# Altium schematic sheet Amplifiers.SchDoc
size A4; SheetNumber: 7; SheetTotal: 9
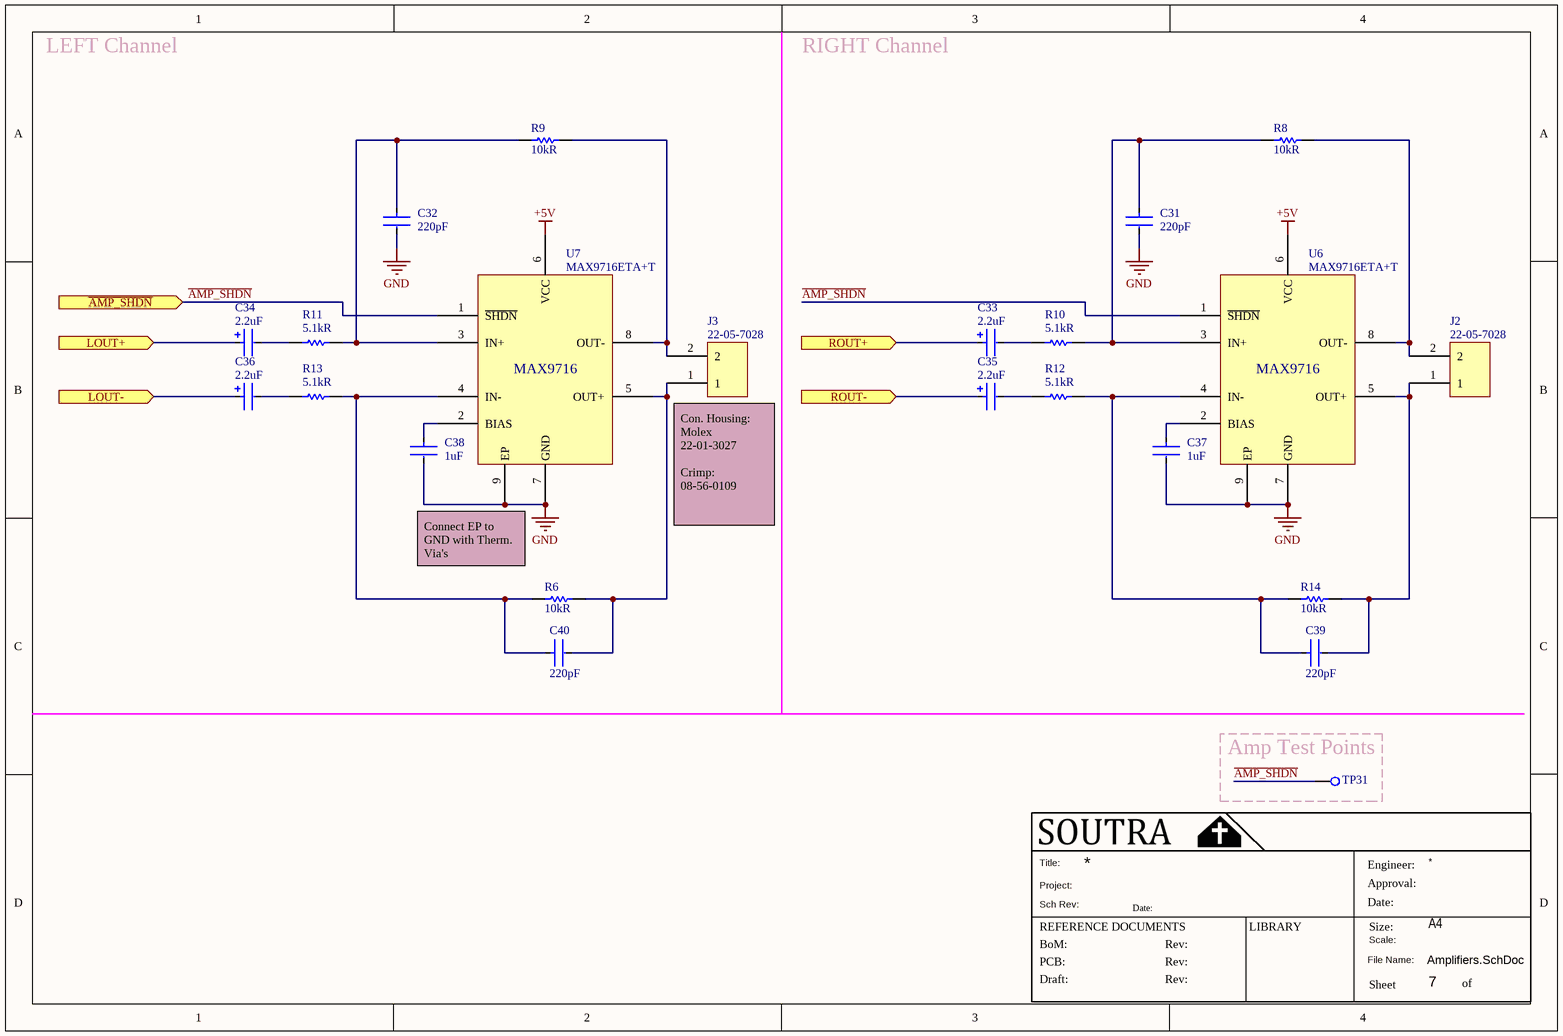
[diagram p0: Amplifiers.SchDoc]

## Parts
C31  value 220pF  [CAPC1005X06L]  (hidden comment: CC0402KPX7R9BB221)
C32  value 220pF  [CAPC1005X06L]  (hidden comment: CC0402KPX7R9BB221)
C33  value 2.2uF  [CAPC2113X120X50ML20T30]  (hidden comment: TAJR225K016RNJ)
C34  value 2.2uF  [CAPC2113X120X50ML20T30]  (hidden comment: TAJR225K016RNJ)
C35  value 2.2uF  [CAPC2113X120X50ML20T30]  (hidden comment: TAJR225K016RNJ)
C36  value 2.2uF  [CAPC2113X120X50ML20T30]  (hidden comment: TAJR225K016RNJ)
C37  value 1uF  [CAPC1005X06L]  (hidden comment: CC0402KRX5R6BB105)
C38  value 1uF  [CAPC1005X06L]  (hidden comment: CC0402KRX5R6BB105)
C39  value 220pF  [CAPC1005X06L]  (hidden comment: CC0402KPX7R9BB221)
C40  value 220pF  [CAPC1005X06L]  (hidden comment: CC0402KPX7R9BB221)
J2  22-05-7028  [J_MOLEX_22-05-7028]
J3  22-05-7028  [J_MOLEX_22-05-7028]
R6  value 10kR  [RESC_0805_2013X50X30LL20T20]  (hidden comment: RC0805JR-0710KL)
R8  value 10kR  [RESC_0805_2013X50X30LL20T20]  (hidden comment: RC0805JR-0710KL)
R9  value 10kR  [RESC_0805_2013X50X30LL20T20]  (hidden comment: RC0805JR-0710KL)
R10  value 5.1kR  [RESC_0603_1608X06L]  (hidden comment: MCMR06X512JTL)
R11  value 5.1kR  [RESC_0603_1608X06L]  (hidden comment: MCMR06X512JTL)
R12  value 5.1kR  [RESC_0603_1608X06L]  (hidden comment: MCMR06X512JTL)
R13  value 5.1kR  [RESC_0603_1608X06L]  (hidden comment: MCMR06X512JTL)
R14  value 10kR  [RESC_0805_2013X50X30LL20T20]  (hidden comment: RC0805JR-0710KL)
TP31  TP_CIRCLE_R1  [TP_CIRCLE_R1]  (value not drawn)
U6  MAX9716ETA+T  [TDFN300X300X80_HS-9L]
U7  MAX9716ETA+T  [TDFN300X300X80_HS-9L]

## Blocks framed on the sheet
Amp Test Points: TP31

## Ports
LOUT+ (in, see Block Diagram[4B], CODEC[3B], IOa[3A]), LOUT- (in, see Block Diagram[4B], CODEC[3B]), ROUT+ (in, see Block Diagram[4B], CODEC[3B], IOa[3A]), ROUT- (in, see Block Diagram[4B], CODEC[3B]), ~{AMP_SHDN} (in, see Block Diagram[3B], MCU[2C])

## Nets
+5V: U6.6(VCC) U7.6(VCC)
GND: C31.2 C32.2 C37.2 C38.2 U6.7(GND) U6.9(EP) U7.7(GND) U7.9(EP)
~{AMP_SHDN}: TP31.1 U6.1(~{SHDN}) U7.1(~{SHDN}) ; port ~{AMP_SHDN}
LOUT+: C34.1 ; port LOUT+
LOUT-: C36.1 ; port LOUT-
ROUT+: C33.1 ; port ROUT+
ROUT-: C35.1 ; port ROUT-
NetC31_1: C31.1 R8.2 R10.2 U6.3(IN+)
NetC32_1: C32.1 R9.2 R11.2 U7.3(IN+)
NetC33_2: C33.2 R10.1
NetC34_2: C34.2 R11.1
NetC35_2: C35.2 R12.1
NetC36_2: C36.2 R13.1
NetC37_1: C37.1 U6.2(BIAS)
NetC38_1: C38.1 U7.2(BIAS)
NetC39_1: C39.1 R12.2 R14.2 U6.4(IN-)
NetC39_2: C39.2 J2.1 R14.1 U6.5(OUT+)
NetC40_1: C40.1 R6.2 R13.2 U7.4(IN-)
NetC40_2: C40.2 J3.1 R6.1 U7.5(OUT+)
NetJ2_2: J2.2 R8.1 U6.8(OUT-)
NetJ3_2: J3.2 R9.1 U7.8(OUT-)

## Notes on the sheet
- LEFT Channel
- RIGHT Channel
- (near J3) Con. Housing:
  Molex 22-01-3027
  Crimp:
  08-56-0109
- Connect EP to GND with Therm. Via's
- Title:
- Project:
- Sch Rev:
- Date:
- Engineer:
- Approval:
- REFERENCE DOCUMENTS
- BoM:
- PCB:
- Draft:
- Rev:
- LIBRARY
- File Name:
- Scale:
- Size:
- Sheet
- A4
- of
- (in symbol MAX9716ETA+T) MAX9716

## Library data of the parts
C31 C32 C39 C40 = CC0402KPX7R9BB221: Ceramic Capacitor, Multilayer, Ceramic, 50V, 10% +Tol, 10% -Tol, X7R, 15% TC, 0.00022uF, Surface Mount, 0402; Manufacturer: Yageo; Alternative Part: MC0402B221K500CT; Multilayer: Yes; Supplier 1: Farnell; Supplier Part Number 1: 4254872; Manufacturer Part Number: CC0402KPX7R9BB221; RoHS: Yes; Category: Ceramic Capacitors; Stock 1: 49750; Pricing 1: 10=0.0069, 500=0.0055, 2500=0.0042, 10000=0.003, 25000=0.0029, 50000=0.0028, 250000=0.0027, 500000=0.0026 (GBP); Mounting Technology: Surface Mount; Pins: 2; Dielectric Material: Ceramic; Package Shape: Rectangular; Case/Package: 0402; Terminal Finish: Nickel; Min Operating Temperature: -55°C; Max Operating Temperature: 125°C; JESD-609 Code: e3; Capacitor Type: Ceramic; Tolerance  (fill in as +-): 10%; Package Style: SMTMeter; Packaging: Tape and Reel; Tolerance (fill in as +-): 10%; Rated DC Voltage (URdc): 50V; Temperature Characteristics Code: X7R; Termination: Wraparound; Length: 1mm; Width: 0.5mm; Height: 0.5mm; Reach SVHC Compliant: Yes; RoHS Compliant: Yes; ComponentLink1URL: https://datasheet.ciiva.com:443/pdfs/VipMasterIC/IC/YAGO/YAGO-S-A0003557223/YAGO-S-A0003557223-1.pdf?src-supplier=IHS+Markit; ComponentLink1Description: https://datasheet.ciiva.com:443/pdfs/VipMasterIC/IC/YAGO/YAGO-S-A0003557223/YAGO-S-A0003557223-1.pdf?src-supplier=IHS+Markit; ComponentLink2URL: https://datasheet.ciiva.com/13208/upy-gphc-x7r-6-3v-to-50v-8-12304-13208487.pdf?src-supplier=Mouser; ComponentLink2Description: https://datasheet.ciiva.com/13208/upy-gphc-x7r-6-3v-to-50v-8-12304-13208487.pdf?src-supplier=Mouser; Supplier 2: Digikey; Supplier Part Number 2: 311-1035-1-ND; Stock 2: 333936; Pricing 2: 1=0.08, 10=0.016, 50=0.0092, 100=0.007; Alternative Part Supplier: Farnell; Alternative Part Supplier Part Number: 1758981
C33-C36 = TAJR225K016RNJ: Surface Mount Tantalum Capacitor, 2.2 µF, 16 V, 0805 [2012 Metric], ± 10%, 6.5 ohm, R; Manufacturer: AVX Interconnect / Elco; Part Number: TAJR225K016RNJ; Supplier 1: Farnell; Supplier Part Number 1: 2112773; Pricing 1: 5=0.3684, 50=0.2592; Stock 1: 340; Manufacturer Part Number: TAJR225K016RNJ
C37 C38 = CC0402KRX5R6BB105: Ceramic Capacitor, Multilayer, Ceramic, 10V, 10% +Tol, 10% -Tol, X5R, 15% TC, 1uF, Surface Mount, 0402; Manufacturer: Yageo; Alternative Part: 0402ZD105KAT2A; Alternative Part Manufacturer: KYOCERA AVX; Multilayer: Yes; Supplier: Farnell; Supplier Part Number: 1458896; Manufacturer Part Number: CC0402KRX5R6BB105; RoHS: Yes; Category: Ceramic Capacitors; Stock: 12220000; Pricing: 10=0.039, 100=0.023; Mounting Technology: Surface Mount; Pins: 2; Dielectric Material: Ceramic; Package Shape: Rectangular; Case/Package: 0402; Terminal Finish: Nickel; Min Operating Temperature: -55°C; Max Operating Temperature: 85°C; JESD-609 Code: e3; Capacitor Type: Ceramic; Tolerance  (fill in as +-): 10%; Package Style: SMTMeter; Packaging: Tape and Reel; Tolerance (fill in as +-): 10%; Rated DC Voltage (URdc): 10V; Temperature Characteristics Code: X5R; Termination: Wraparound; Length: 1mm; Width: 0.5mm; Height: 0.5mm; Reach SVHC Compliant: Yes; RoHS Compliant: Yes; ComponentLink1URL: https://datasheet.ciiva.com:443/pdfs/VipMasterIC/IC/YAGO/YAGO-S-A0006851646/YAGO-S-A0006851646-1.pdf?src-supplier=IHS+Markit; ComponentLink1Description: https://datasheet.ciiva.com:443/pdfs/VipMasterIC/IC/YAGO/YAGO-S-A0006851646/YAGO-S-A0006851646-1.pdf?src-supplier=IHS+Markit; ComponentLink2URL: https://datasheet.ciiva.com/176/upy-gphc-x5r-4v-to-50v-12-176704.pdf?src-supplier=Digi-Key; ComponentLink2Description: https://datasheet.ciiva.com/176/upy-gphc-x5r-4v-to-50v-12-176704.pdf?src-supplier=Digi-Key; ComponentLink3URL: https://datasheet.ciiva.com/176/mlccorderingcode-176705.pdf?src-supplier=Digi-Key; ComponentLink3Description: https://datasheet.ciiva.com/176/mlccorderingcode-176705.pdf?src-supplier=Digi-Key; ComponentLink4URL: https://datasheet.ciiva.com/176/mlccorderingcode-176706.pdf?src-supplier=Digi-Key; ComponentLink4Description: https://datasheet.ciiva.com/176/mlccorderingcode-176706.pdf?src-supplier=Digi-Key; Supplier 1: Digikey; Supplier Part Number 1: 311-1439-1-ND; Pricing 1: 1=0.08, 10=0.058, 50=0.034, 100=0.027; Alternative Part Supplier: Farnell; Alternative Part Supplier Part Number: 1740588
J2 J3 = 22-05-7028: Board Connector, 2 Contact(s), 1 Row(s), Male, Right Angle, 0.1 inch Pitch, Solder Terminal, Locking, Natural Insulator, Receptacle; Manufacturer: Molex; Option: General Purpose; Filter Feature: No; Mating Information: MULTIPLE MATING PARTS AVAILABLE; Number of Rows Loaded: 1; Number of Contacts: 2; Contact Pattern: RECTANGULAR; Contact Resistance: 10mR; Contact Style: SQ PIN-SKT; Durability: 50Cycles; Insulation Resistance: 1GR; Polarization Key: POLARIZED HOUSING; Rated Current (Signal): 4A; Body Breadth: 0.228inch; Body Depth: 0.568inch; Body Length: 0.2inch; Plating Thickness: 60uin; Reference Standard: UL; Reliability: COMMERCIAL; Insertion Force-Max: 1.946N; Withdrawl Force-Min: 0.556N; Supplier 1: Farnell; Supplier Part Number 1: 9731601; Manufacturer Part Number: 22-05-7028; RoHS: Yes; Category: Headers and Wire Housings; Mounting Technology: Board; Contact Finish - Mating: TIN (200); Contact Finish - Termination: Tin (Sn); Insulation Color: Natural; Insulation Material: Nylon; Min Operating Temperature: -40°C; Max Operating Temperature: 105°C; Connector Type: BOARD CONNECTOR; Contact Gender: Male; Mixed Contacts: No; Mounting Style: RIGHT ANGLE; Termination: Solder; JESD-609 Code: e3; Body/Shell Style: RECEPTACLE; Number Of Connectors: 1; Number Of PCB Rows: 1; PCB Contact Pattern: RECTANGULAR; Terminal Pitch: 2.54mm; Mating Contact Pitch: 0.1inch; Mounting Option 1: LOCKING; Terminal Length: 0.15inch; Flammability Rating: UL94 V-0; Reach SVHC Compliant: Yes; RoHS Compliant: Yes; DIN Conformance: No; IEC Conformance: No; MIL Conformance: No; ComponentLink1URL: https://datasheet.ciiva.com:443/pdfs/VipMasterIC/IC/MOLE/MOLE-S-A0002841204/MOLE-S-A0002841204-1.pdf?src-supplier=IHS+Markit; ComponentLink1Description: https://datasheet.ciiva.com:443/pdfs/VipMasterIC/IC/MOLE/MOLE-S-A0002841204/MOLE-S-A0002841204-1.pdf?src-supplier=IHS+Markit; ComponentLink2URL: http://www.farnell.com/datasheets/2700806.pdf?src-supplier=Farnell; ComponentLink2Description: http://www.farnell.com/datasheets/2700806.pdf?src-supplier=Farnell; Stock 1: 34887; Pricing 1: 1=0.78, 10=0.64, 50=0.57, 100=0.50; ComponentLink3URL: http://datasheet.octopart.com/22-05-7028-Molex-datasheet-10979095.pdf?src-supplier=Avnet; ComponentLink3Description: http://datasheet.octopart.com/22-05-7028-Molex-datasheet-10979095.pdf?src-supplier=Avnet
R6 R8 R9 R14 = RC0805JR-0710KL: Fixed Resistor, Metal Glaze/thick Film, 0.125W, 10000ohm, 150V, 5% +/-Tol, 100ppm/Cel, Surface Mount, 0805; Manufacturer: Yageo; Alternative Part: MCMR08X103 JTL; Additional Feature: LASER TRIMMABLE; Power: 125mW; Rated Temperature: 70°C; Temperature Coefficient: 100ppm/°C; Package Height: 0.5mm; Package Length: 2mm; Package Width: 1.25mm; Supplier: Farnell; Supplier Part Number: 9234136; Manufacturer Part Number: RC0805JR-0710KL; RoHS: Yes; Category: Chip SMD Resistors; Stock: 893694; Pricing: 10=0.013, 100=0.007, 500=0.006; Mounting Technology: Surface Mount; Pins: 2; Package Shape: Rectangular; Case/Package: 0805; Terminal Finish: Nickel; Min Operating Temperature: -55°C; Max Operating Temperature: 155°C; Tolerance: 5%; JESD-609 Code: e3; Resistor Type: FIXED RESISTOR; Construction: Chip; Package Style: SMTMeter; Packaging: Tape and Reel; Technology: METAL GLAZE/THICK FILM; Termination: Wraparound; Working Voltage: 150V; Reach SVHC Compliant: Yes; RoHS Compliant: Yes; ComponentLink1URL: https://datasheet.ciiva.com:443/pdfs/VipMasterIC/IC/YAGO/YAGO-S-A0008145938/YAGO-S-A0008145938-1.pdf?src-supplier=IHS+Markit; ComponentLink1Description: https://datasheet.ciiva.com:443/pdfs/VipMasterIC/IC/YAGO/YAGO-S-A0008145938/YAGO-S-A0008145938-1.pdf?src-supplier=IHS+Markit; ComponentLink2URL: https://datasheet.ciiva.com/7983/444164-7983765.pdf?src-supplier=Element14; ComponentLink2Description: https://datasheet.ciiva.com/7983/444164-7983765.pdf?src-supplier=Element14; ComponentLink3URL: https://datasheet.ciiva.com/7941/444164-7941870.pdf?src-supplier=Element14; ComponentLink3Description: https://datasheet.ciiva.com/7941/444164-7941870.pdf?src-supplier=Element14; ComponentLink4URL: https://datasheet.ciiva.com/7941/444164-7941871.pdf?src-supplier=Element14; ComponentLink4Description: https://datasheet.ciiva.com/7941/444164-7941871.pdf?src-supplier=Element14; Supplier 1: Digikey; Supplier Part Number 1: 311-10KARCT-ND; Pricing 1: 1=0.08, 10=0.018, 50=0.011, 100=0.009; Alternative Part Supplier: Farnell; Alternative Part Supplier Part Number: 2073612
R10-R13 = MCMR06X512JTL: Fixed Resistor, 0.1W, 5100ohm, 75V, 5% +/-Tol, 100ppm/Cel, Surface Mount, 0603; Manufacturer: Multicomp; Manufacturer Series: MCMR06; Alternative Part: MCMR06X5101FTL; Power: 100mW; Rated Temperature: 70°C; Temperature Coefficient: 100ppm/°C; Reference Standard: AEC-Q200; Supplier 1: Farnell; Supplier Part Number 1: 2073528; Manufacturer Part Number: MCMR06X512JTL; RoHS: Yes; Category: Chip SMD Resistors; Stock 1: 4951; Pricing 1: 10=0.0065, 100=0.0056, 500=0.0047, 1000=0.004, 2500=0.0027, 5000=0.0021, 25000=0.0016, 50000=0.0013 (GBP); Mounting Technology: Surface Mount; Pins: 2; Package Shape: Rectangular; Case/Package: 0603; Terminal Finish: Tin; Min Operating Temperature: -55°C; Max Operating Temperature: 155°C; Tolerance: 5%; JESD-609 Code: e3; Resistor Type: FIXED RESISTOR; Packaging: Tape and Reel; Termination: Wraparound; Working Voltage: 75V; RoHS Compliant: Yes; ComponentLink1URL: https://datasheet.ciiva.com:443/pdfs/VipMasterIC/IC/SCMP/SCMPS00167/SCMPS00167-1.pdf?src-supplier=IHS+Markit; ComponentLink1Description: https://datasheet.ciiva.com:443/pdfs/VipMasterIC/IC/SCMP/SCMPS00167/SCMPS00167-1.pdf?src-supplier=IHS+Markit; ComponentLink2URL: https://datasheet.ciiva.com/28686/1716707-28686598.pdf?src-supplier=Element14; ComponentLink2Description: https://datasheet.ciiva.com/28686/1716707-28686598.pdf?src-supplier=Element14; Alternative Part Supplier: Farnell; Alternative Part Supplier Part Number: 2073522
TP31 = TP_CIRCLE_R1: Test Point, SMD, Circular, Radius = 1mm
U6 U7 = MAX9716ETA+T: Audio Amplifier, 1.4W, 1 Channel(s), 1 Func, BICMOS; Manufacturer: Maxim; Bandwidth-Nom: 22kHz; Number of Channels: 1; Package Equivalence Code: SOLCC8,.12,25; Power Supplies: 3/5V; Max Supply Current: 8mA; Max Supply Voltage: 5.5V; Min Supply Voltage: 2.7V; Qualification Status: Not Qualified; Supplier: Farnell; Supplier Part Number: 2516304; Manufacturer Part Number: MAX9716ETA+T; RoHS: Yes; Category: Amplifiers - Audio; Stock: 3265; Pricing: 1=1.41, 10=1.26, 25=1.19, 100=0.982; Case/Package: HVSON; Pins: 8; Package Shape: Square; Terminal Finish: Tin; Min Operating Temperature: -40°C; Max Operating Temperature: 85°C; JESD-609 Code: e3; Consumer IC Type: AUDIO AMPLIFIER; JESD-30 Code: S-XDSO-N8; Moisture Sensitivity Level: 1; Channels: 1; Output Power-Nom: 1.4W; Package Style: SMALL OUTLINE, HEAT SINK/SLUG, VERY THIN PROFILEMeter; Peak Reflow Temperature (Cel): 260°C; Surface Mount: Yes; Technology: BICMOS; Terminal Form: No Lead; Terminal Position: DUAL; Length: 3mm; Width: 3mm; Height - Seated (Max): 0.8mm; Terminal Pitch: 0.65mm; Temperature Grade: INDUSTRIAL; Reach SVHC Compliant: Yes; RoHS Compliant: Yes; ComponentLink1URL: https://datasheet.ciiva.com:443/pdfs/VipMasterIC/IC/MAXM/MAXMS12627/MAXMS12627-1.pdf?src-supplier=IHS+Markit; ComponentLink1Description: https://datasheet.ciiva.com:443/pdfs/VipMasterIC/IC/MAXM/MAXMS12627/MAXMS12627-1.pdf?src-supplier=IHS+Markit; ComponentLink2URL: https://datasheet.ciiva.com/1481/388069-1481331.pdf?src-supplier=Element14; ComponentLink2Description: https://datasheet.ciiva.com/1481/388069-1481331.pdf?src-supplier=Element14; ComponentLink3URL: https://datasheet.ciiva.com/1790/max9716-max9717-1790242.pdf?src-supplier=Digikey; ComponentLink3Description: https://datasheet.ciiva.com/1790/max9716-max9717-1790242.pdf?src-supplier=Digikey; ComponentLink4URL: https://datasheet.ciiva.com/1790/max9716-max9717-1790243.pdf?src-supplier=Digikey; ComponentLink4Description: https://datasheet.ciiva.com/1790/max9716-max9717-1790243.pdf?src-supplier=Digikey; ComponentLink5URL: https://datasheet.ciiva.com/1790/max9716-max9717-1790244.pdf?src-supplier=Digikey; ComponentLink5Description: https://datasheet.ciiva.com/1790/max9716-max9717-1790244.pdf?src-supplier=Digikey; ComponentLink6URL: https://datasheet.ciiva.com/2968/max9716-max9717-2968854.pdf?src-supplier=Avnet; ComponentLink6Description: https://datasheet.ciiva.com/2968/max9716-max9717-2968854.pdf?src-supplier=Avnet; Supplier 1: Digikey; Supplier Part Number 1: MAX9716ETA+TCT-ND; Pricing 1: 1=1.28, 10=1.15, 25=1.08, 100=0.92